# EAGLE schematic LiquidCrystal_SR1 (EAGLE 6.1)
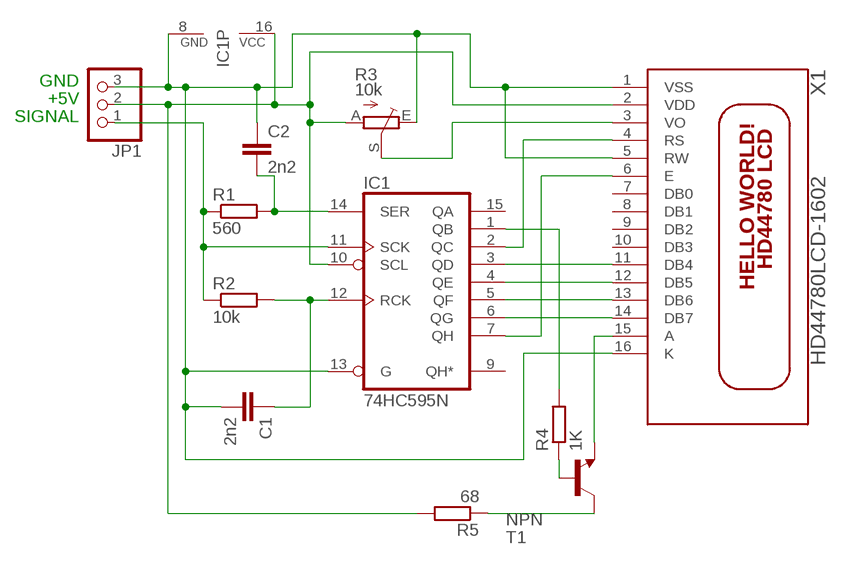
[diagram p0: schematic, sheet 1]

## Parts
C1  2n2  C-EU025-050X050  [C025-050X050]
C2  2n2  C-EU025-050X050  [C025-050X050]
IC1  74HC595N  [DIL16]
JP1  PINHD-1X3  [1X03]
R1  560  R-EU_0207/12  [0207/12]
R2  10k  R-EU_0207/12  [0207/12]
R3  10k  TRIM_EU-CA6V  [CA6V]
R4  1K  R-EU_0207/12  [0207/12]
R5  68  R-EU_0207/12  [0207/12]
T1  NPN  -NPN-TO92-EBC  [TO92-EBC]
X1  HD44780LCD-1602  [LCD1602]

## Nets
N$1: C1.1 IC1.12(RCK) R2.2
N$2: T1.E X1.15(A)
N$3: R3.S X1.3(VO)
N$4: IC1.2(QC) X1.4(RS)
N$5: C2.2 IC1.14(SER) R1.2
N$6: IC1.3(QD) X1.11(DB4)
N$7: IC1.4(QE) X1.12(DB5)
N$8: IC1.5(QF) X1.13(DB6)
N$9: IC1.6(QG) X1.14(DB7)
N$10: IC1.11(SCK) JP1.1 R1.1 R2.1
N$11: IC1.7(QH) X1.6(E)
N$12: IC1.1(QB) R4.2
N$13: R4.1 T1.B
N$14: R5.1 T1.C
VDD [gnd]: IC1.10(SCL) IC1.16(VCC) JP1.2 R3.A R5.2 X1.2(VDD)
VSS [gnd]: C1.2 C2.1 IC1.8(GND) IC1.13(G) JP1.3 R3.E X1.1(VSS) X1.5(RW) X1.16(K)
Unconnected: IC1.9(QH*) IC1.15(QA) X1.7(DB0) X1.8(DB1) X1.9(DB2) X1.10(DB3)

## Notes on the sheet
- GND
- +5V
- SIGNAL

## Library data of the parts
C1 C2 = resistor:C-EU: CAPACITOR, European symbol
IC1 = 74xx-eu:74*595: 8-bit SHIFT REGISTER, output latch
JP1 = adafruit:PINHD-1X3: PIN HEADER
R1 R2 R4 R5 = resistor:R-EU_: RESISTOR, European symbol
R3 = pot:TRIM_EU-: POTENTIOMETER
T1 = transistor:*-NPN-: NPN Transistror BF959 corrected 2008.03.06
X1 = adafruit:HD44780LCD: HD44780 LCD Standard character type LCDs, available in sizes from 8x1 to 40x4!